# EAGLE schematic v1-eyeballs (EAGLE 6.4)
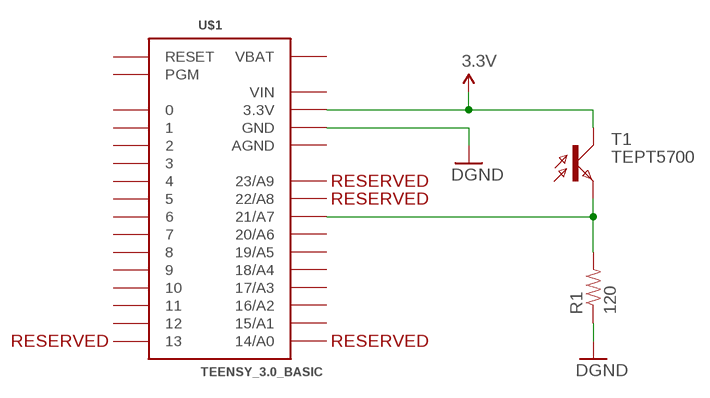
[diagram p0: schematic, sheet 1]

## Parts
R1  120  RESISTOREZ  [AXIAL-0.3EZ]
T1  TEPT5700  BPX81  [BPX81]
U$1  TEENSY_3.0_BASIC  [TEENSY_3.0_BASIC]

## Nets
3.3V: T1.C U$1.3.3V U$1.3.3V1(3.3V)
GND: R1.P$1 U$1.GND U$1.GND1(GND) ; supply symbol labelled DGND
N$4: R1.P$2 T1.E U$1.21/A7
Unconnected: U$1.0 U$1.1 U$1.2 U$1.3 U$1.4 U$1.5 U$1.6 U$1.7 U$1.8 U$1.9 U$1.10 U$1.11 U$1.12 U$1.13 U$1.14/A0 U$1.15/A1 U$1.16/A2 U$1.17/A3 U$1.18/A4 U$1.19/A5 U$1.20/A6 U$1.22/A8 U$1.23/A9 U$1.PGM U$1.RESET

## Notes on the sheet
- RESERVED
- RESERVED
- RESERVED | RESERVED

## Power pins joined to a net without a drawn wire
AGND: U$1.AGND
VBAT: U$1.VBAT
VIN: U$1.VIN

## Library data of the parts
R1 = SparkFun-Passives:RESISTOR: Resistor Basic schematic elements and footprints for 0603, 1206, and PTH resistors.
T1 = opto-trans-siemens:BPX81: PHOTO TRANSISTOR; OC_FARNELL: unknown; OC_NEWARK: unknown
U$1 = Teensy3.0:TEENSY_3.0_BASIC: Basic Teensy 3.0 with none of the 'inner' pins enabled. See '+4', 'AllAnalogPins", and 'AllPins' packages for additional pin holes, as needed.